# Altium schematic sheet Schematic Blocks.SchDoc
size A4; DocumentNumber: 1; SheetNumber: 1; SheetTotal: 11
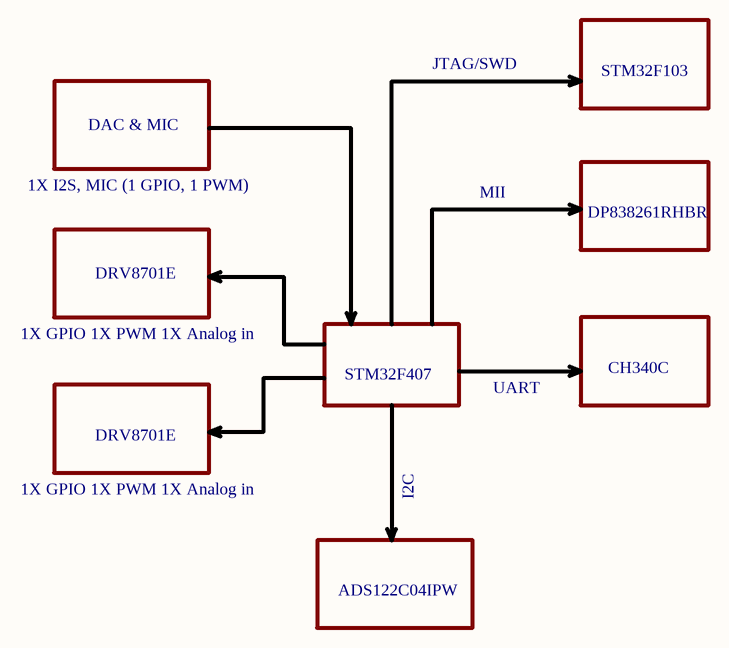
[diagram p0: Schematic Blocks.SchDoc]

## Notes on the sheet
- JTAG/SWD
- STM32F103
- DAC & MIC
- 1X I2S, MIC (1 GPIO, 1 PWM)
- MII
- DP838261RHBR
- DRV8701E
- 1X GPIO 1X PWM 1X Analog in
- STM32F407
- CH340C
- UART
- I2C
- ADS122C04IPW